# EAGLE board headstage-64_bno55 (EAGLE 9.0.1), part 1 of 2
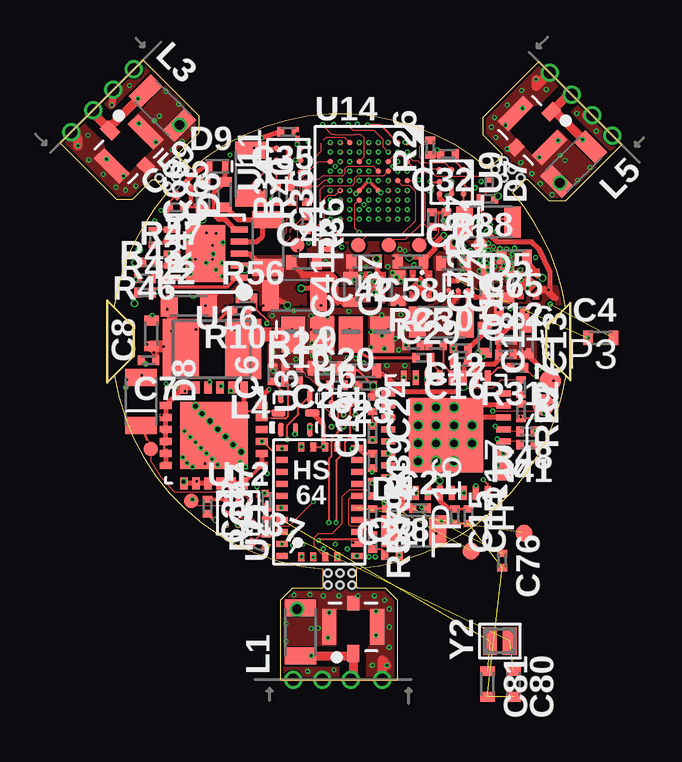
[diagram p5: board, top side]
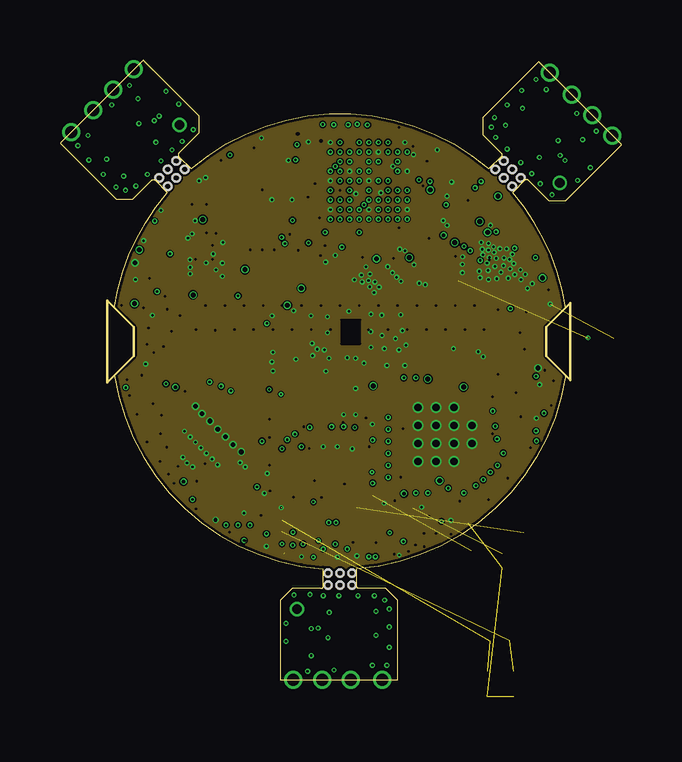
[diagram p6: board, inner layer GND1]
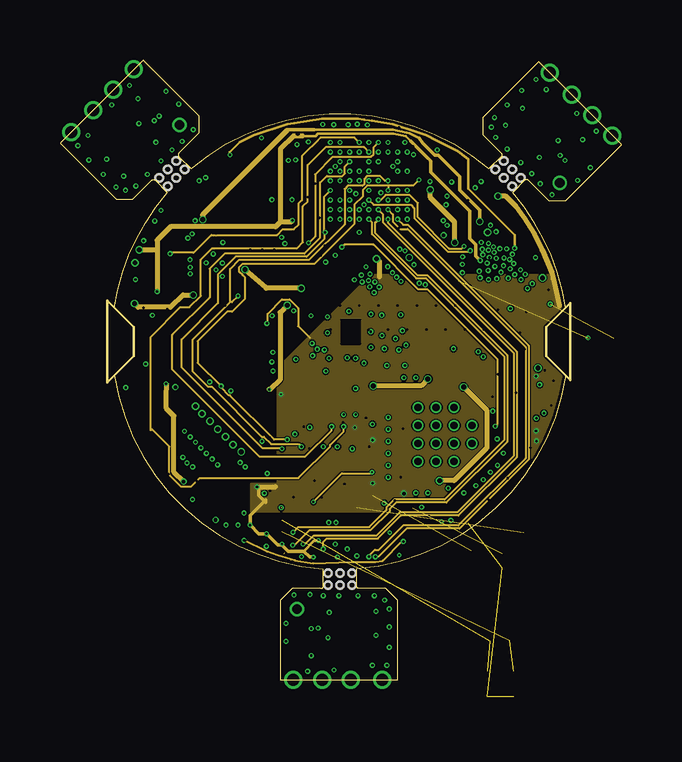
[diagram p7: board, inner layer Route2/PWR]
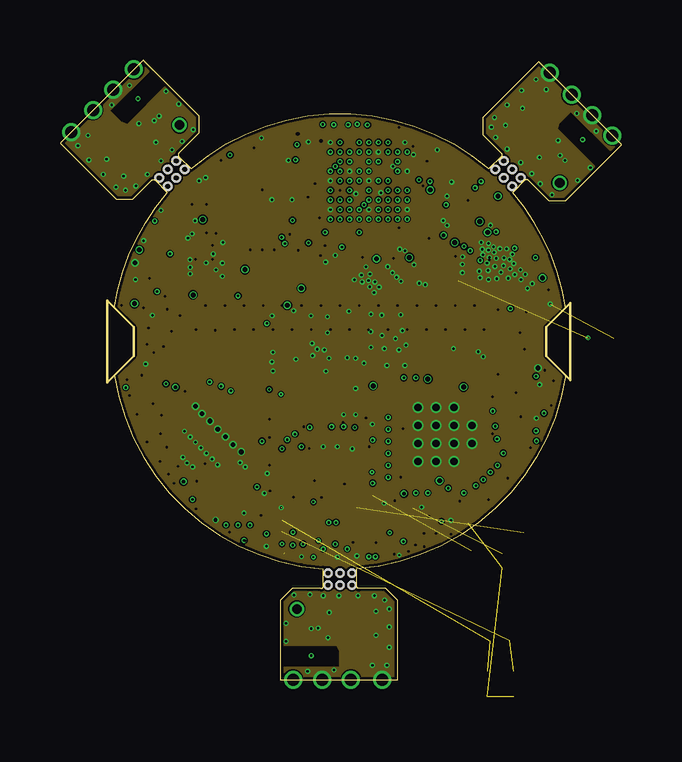
[diagram p8: board, inner layer GND2]
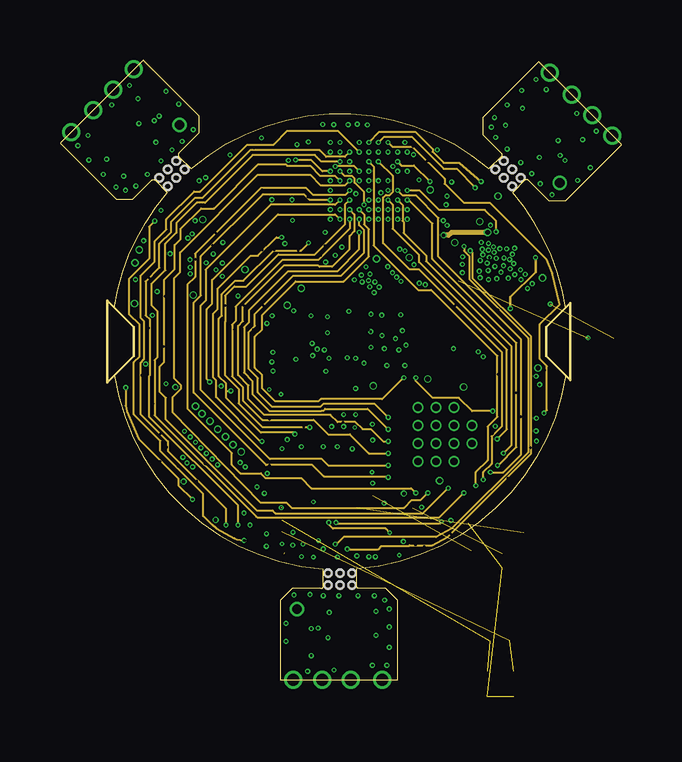
[diagram p9: board, inner layer Route3]
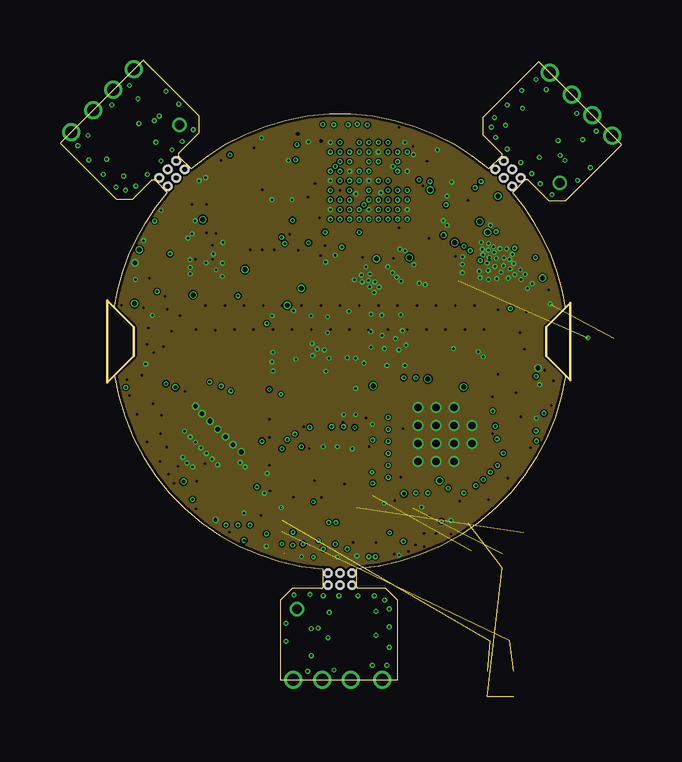
[diagram p10: board, inner layer GND3]
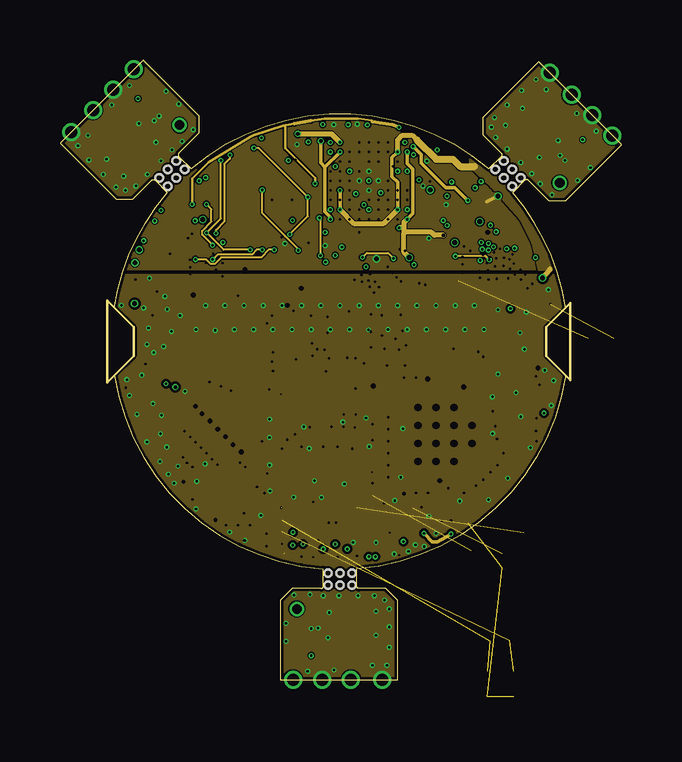
[diagram p11: board, inner layer AGND/PWR]
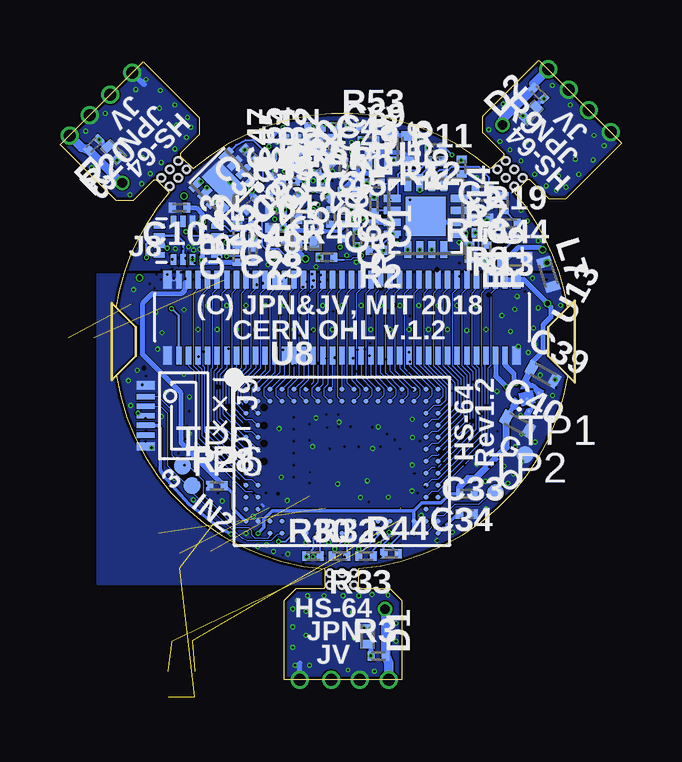
[diagram p12: board, bottom side, seen from below]

Size 23.41 x 25.84 mm. Coordinates in mm from the lower left corner, seen from the top.
Outline: 2.27,15.5 3.07,14.7 3.07,13.5 2.27,12.7 arc77 10.97,4.62 10.97,3.9 arc-90 10.87,3.8 9.67,3.8 9.17,3.3 9.17,0 14.07,0 14.07,3.3 13.57,3.8 12.47,3.8 arc-90 12.37,3.9 12.37,4.62 arc77 21.07,12.7 20.27,13.5 20.27,14.7 21.07,15.5 arc32 18.87,20.3 19.37,20.82 arc-90 19.52,20.82 20.36,19.97 21.07,19.97 23.41,22.3 19.94,25.77 17.61,23.43 17.61,22.73 18.39,21.95 arc-90 18.39,21.81 17.87,21.3 arc81 5.47,21.3 4.95,21.81 arc-90 4.95,21.95 5.8,22.8 5.8,23.5 3.47,25.84 0,22.37 2.33,20.04 3.04,20.04 3.82,20.82 arc-90 3.96,20.82 4.47,20.3 arc32 2.27,15.5
Copper layers ((1*2*3*4*5*6)+(7*16)): Top 0.036mm / dielectric 4mil / GND1 0.036mm / dielectric 5mil / Route2/PWR 0.036mm / dielectric 0.10921875mm / GND2 0.036mm / dielectric 5mil / Route3 0.036mm / dielectric 4mil / GND3 0.035mm / dielectric 0.15mm / AGND/PWR 0.035mm / dielectric 0.2mm / Bottom 0.036mm
Design rules "headstage-256": minimum track width 2mil, minimum drill 3mil, track to track 2mil, track to pad 2mil, pad to pad 2mil, via to via 2mil, smd to smd 2mil, copper to edge 5mil, drill to drill 5mil, minimum pad ring 2mil, minimum via ring 2mil, stop-mask expansion 1mil, vias tented up to drill 1mm, thermal gap 10mil
Net classes: 1 thick: width 0.1 mm; 2 diff: width 0.076 mm, drill 0.1 mm, clearance 0.051 mm
Holes 0.3 mm at 4.84,20.92 4.49,21.28 4.14,20.92 4.84,21.63 4.49,20.57 5.2,21.28 11.67,4.45 11.67,3.95 12.17,3.95 11.17,3.95 12.17,4.45 11.17,4.45 18.49,20.92 18.84,21.28 18.49,21.63 19.2,20.92 18.14,21.28 18.84,20.57
tKeepout: area 2.2,11.2 to 3.7,17; area 2.2,11.2 to 3.7,17; area 19.7,11.2 to 21.2,17; area 19.7,11.2 to 21.2,17
tRestrict: area 1,21.2 to 3.7,24.1; area 11.6,0 to 12.9,2.8; area 18.8,22 to 21.6,24.8; area 11.4,13.6 to 12.8,15.2; 4 lines
Milling: 8 lines

## Footprints (pad centres in the part's own frame; a part is rotated, then mirrored left to right if it is on the bottom)
0201T = smd 0.3 x 0.4: 1 -0.3,0; 2 0.3,0
0402T = smd 0.4 x 0.6: 1 -0.533,0; 2 0.533,0
0402T-DFN = smd 0.35 x 0.6: A -0.325,0; C 0.325,0
0805PT = smd 0.7 x 1.3: A -1,0; C 1,0
LED-0201T = smd 0.2 x 0.35: 1 -0.2,0; 2 0.2,0
CLP1006-2L = smd 0.24 x 0.49: A -0.325,0; C 0.325,0
X_FL_R_SMT_1(02) = smd 0.5 x 0.7: P$1 0,-1.1 | smd 0.6 x 1.5: P$2 -1,0; P$4 1,0 | smd 0.5 x 0.6: P$3 0,1
HEADSTAGE64-DAUGHER-CARD-CASTELLATED = drill 0.5: 1 -2.4,0; 2 -1.2,0; 3 0,0; 4 1.3,0
HEADSTAGE-64-DAUGHTER-CARD = smd 1 x 1.5: 1 -2.4,-0.1; 2 -1.2,-0.1; 3 0,-0.1; 4 1.3,-0.1
DF40-70HEAD-LESS-SILK = smd 0.23 x 0.75: 1 -6.8,-1.585; 2 -6.4,-1.585; 3 -6,-1.585; 4 -5.6,-1.585; 5 -5.2,-1.585; 6 -4.8,-1.585; 7 -4.4,-1.585; 8 -4,-1.585; 9 -3.6,-1.585; 10 -3.2,-1.585; 11 -2.8,-1.585; 12 -2.4,-1.585; 13 -2,-1.585; 14 -1.6,-1.585; 15 -1.2,-1.585; 16 -0.8,-1.585; 17 -0.4,-1.585; 18 0,-1.585; 19 0.4,-1.585; 20 0.8,-1.585; 21 1.2,-1.585; 22 1.6,-1.585; 23 2,-1.585; 24 2.4,-1.585; 25 2.8,-1.585; 26 3.2,-1.585; 27 3.6,-1.585; 28 4,-1.585; 29 4.4,-1.585; 30 4.8,-1.585; 31 5.2,-1.585; 32 5.6,-1.585; 33 6,-1.585; 34 6.4,-1.585; 35 6.8,-1.585; 36 6.8,1.585; 37 6.4,1.585; 38 6,1.585; 39 5.6,1.585; 40 5.2,1.585; 41 4.8,1.585; 42 4.4,1.585; 43 4,1.585; 44 3.6,1.585; 45 3.2,1.585; 46 2.8,1.585; 47 2.4,1.585; 48 2,1.585; 49 1.6,1.585; 50 1.2,1.585; 51 0.8,1.585; 52 0.4,1.585; 53 0,1.585; 54 -0.4,1.585; 55 -0.8,1.585; 56 -1.2,1.585; 57 -1.6,1.585; 58 -2,1.585; 59 -2.4,1.585; 60 -2.8,1.585; 61 -3.2,1.585; 62 -3.6,1.585; 63 -4,1.585; 64 -4.4,1.585; 65 -4.8,1.585; 66 -5.2,1.585; 67 -5.6,1.585; 68 -6,1.585; 69 -6.4,1.585; 70 -6.8,1.585 | smd 0.35 x 0.75: M1 -7.275,-1.585; M2 7.275,-1.585; M3 7.275,1.585; M4 -7.275,1.585
DF40-10HEAD_HALF = smd 0.23 x 0.75: 1 -0.8,-1.585; 2 -0.4,-1.585; 3 0,-1.585; 4 0.4,-1.585; 5 0.8,-1.585 | smd 0.35 x 0.75: M1 -1.275,-1.585; M2 1.275,-1.585
0805T = smd 0.7 x 1.3: 1 -1,0; 2 1,0
0603T = smd 0.7 x 0.9: 1 -0.82,0; 2 0.82,0
1210T = smd 1.5 x 2.5: 1 -1.3,0; 2 1.3,0
TP07R = smd 0.7 x 0.7: TP 0,0
TP09R = smd 0.9 x 0.9: TP 0,0
TP06R = smd 0.6 x 0.6: TP 0,0
CP_16_27-L = smd 0.711 x 0.305: 1 -1.397,0.75; 2 -1.397,0.25; 3 -1.397,-0.25; 4 -1.397,-0.75; 9 1.397,-0.75; 10 1.397,-0.25; 11 1.397,0.25; 12 1.397,0.75 | smd 0.305 x 0.711: 5 -0.75,-1.397; 6 -0.25,-1.397; 7 0.25,-1.397; 8 0.75,-1.397; 13 0.75,1.397; 14 0.25,1.397; 15 -0.25,1.397; 16 -0.75,1.397 | smd 1.651 x 1.651: PAD 0,0
CP_8_10-L = smd 0.635 x 0.305: 1 -0.889,0.75; 2 -0.889,0.25; 3 -0.889,-0.25; 4 -0.889,-0.75; 5 0.889,-0.75; 6 0.889,-0.25; 7 0.889,0.25; 8 0.889,0.75 | smd 0.991 x 1.6: PAD 0,0
QFN24-4X4 = smd 0.5 x 0.3: 1 -2,1.25; 2 -2,0.75; 3 -2,0.25; 4 -2,-0.25; 5 -2,-0.75; 6 -2,-1.25; 13 2,-1.25; 14 2,-0.75; 15 2,-0.25; 16 2,0.25; 17 2,0.75; 18 2,1.25 | smd 0.3 x 0.5: 7 -1.25,-2; 8 -0.75,-2; 9 -0.25,-2; 10 0.25,-2; 11 0.75,-2; 12 1.25,-2; 19 1.25,2; 20 0.75,2; 21 0.25,2; 22 -0.25,2; 23 -0.75,2; 24 -1.25,2 | smd 2.8 x 2.8: PAD 0,0
UQFN = smd 0.55 x 0.25: 1 -0.7,0.6; 3 -0.7,-0.6; 5 0.7,-0.6; 7 0.7,0.6 | smd 0.55 x 0.2: 2 -0.7,0; 6 0.7,0 | smd 0.3 x 0.6: 4 0,-0.7; 8 0,0.7
MQFN16-1.8X2.6 = smd 0.663 x 0.225: 1 -0.7,0.6 | smd 0.463 x 0.225: 2 -0.8,0.2; 3 -0.8,-0.2; 4 -0.8,-0.6; 9 0.8,-0.6; 10 0.8,-0.2; 11 0.8,0.2; 12 0.8,0.6 | smd 0.225 x 0.463: 5 -0.6,-1.2; 6 -0.2,-1.2; 7 0.2,-1.2; 8 0.6,-1.2; 13 0.6,1.2; 14 0.2,1.2; 15 -0.2,1.2; 16 -0.6,1.2
WLCSP3X3 = smd 0.25 x 0.25: A1 -0.5,0.5; A2 0,0.5; A3 0.5,0.5; B1 -0.5,0; B2 0,0; B3 0.5,0; C1 -0.5,-0.5; C2 0,-0.5; C3 0.5,-0.5
BGA104_0.5MM = smd 0.2 x 0.2: A1 -4,3; A2 -3.5,3; A3 -3,3; A4 -2.5,3; A5 -2,3; A6 -1.5,3; A7 -1,3; A8 -0.5,3; A9 0,3; A10 0.5,3; A11 1,3; A12 1.5,3; A13 2,3; A14 2.5,3; A15 3,3; A16 3.5,3; A17 4,3; B1 -4,2.5; B2 -3.5,2.5; B3 -3,2.5; B4 -2.5,2.5; B5 -2,2.5; B6 -1.5,2.5; B7 -1,2.5; B8 -0.5,2.5; B9 0,2.5; B10 0.5,2.5; B11 1,2.5; B12 1.5,2.5; B13 2,2.5; B14 2.5,2.5; B15 3,2.5; B16 3.5,2.5; B17 4,2.5; C1 -4,2; C2 -3.5,2; C16 3.5,2; C17 4,2; D1 -4,1.5; D2 -3.5,1.5; D16 3.5,1.5; D17 4,1.5; E1 -4,1; E2 -3.5,1; E16 3.5,1; E17 4,1; F1 -4,0.5; F2 -3.5,0.5; F16 3.5,0.5; F17 4,0.5; G1 -4,0; G2 -3.5,0; G16 3.5,0; G17 4,0; H1 -4,-0.5; H2 -3.5,-0.5; H16 3.5,-0.5; H17 4,-0.5; J1 -4,-1; J2 -3.5,-1; J16 3.5,-1; J17 4,-1; K1 -4,-1.5; K2 -3.5,-1.5; K16 3.5,-1.5; K17 4,-1.5; L1 -4,-2; L2 -3.5,-2; L16 3.5,-2; L17 4,-2; M1 -4,-2.5; M2 -3.5,-2.5; M3 -3,-2.5; M4 -2.5,-2.5; M5 -2,-2.5; M6 -1.5,-2.5; M7 -1,-2.5; M8 -0.5,-2.5; M9 0,-2.5; M10 0.5,-2.5; M11 1,-2.5; M12 1.5,-2.5; M13 2,-2.5; M14 2.5,-2.5; M15 3,-2.5; M16 3.5,-2.5; M17 4,-2.5; N1 -4,-3; N2 -3.5,-3; N3 -3,-3; N4 -2.5,-3; N5 -2,-3; N6 -1.5,-3; N7 -1,-3; N8 -0.5,-3; N9 0,-3; N10 0.5,-3; N11 1,-3; N12 1.5,-3; N13 2,-3; N14 2.5,-3; N15 3,-3; N16 3.5,-3; N17 4,-3
WQFN32-5X5 = smd 0.25 x 0.6: 1 1.75,2.4; 2 1.25,2.4; 3 0.75,2.4; 4 0.25,2.4; 5 -0.25,2.4; 6 -0.75,2.4; 7 -1.25,2.4; 8 -1.75,2.4; 17 -1.75,-2.4; 18 -1.25,-2.4; 19 -0.75,-2.4; 20 -0.25,-2.4; 21 0.25,-2.4; 22 0.75,-2.4; 23 1.25,-2.4; 24 1.75,-2.4 | smd 0.6 x 0.25: 9 -2.4,1.75; 10 -2.4,1.25; 11 -2.4,0.75; 12 -2.4,0.25; 13 -2.4,-0.25; 14 -2.4,-0.75; 15 -2.4,-1.25; 16 -2.4,-1.75; 25 2.4,-1.75; 26 2.4,-1.25; 27 2.4,-0.75; 28 2.4,-0.25; 29 2.4,0.25; 30 2.4,0.75; 31 2.4,1.25; 32 2.4,1.75 | smd 3.1 x 3.1: PAD 0,0
X2SON = smd 0.1 x 0.1: 1 -0.43,0.33; 2 -0.43,-0.33; 3 0.43,-0.33; 4 0.43,0.33 | smd 0.1 x 0.1 rotated 45: PAD 0,0
VBGA81-4X4 = smd 0.23 x 0.23: A1 1.6,1.6; A2 1.2,1.6; A3 0.8,1.6; A4 0.4,1.6; A5 0,1.6; A6 -0.4,1.6; A7 -0.8,1.6; A8 -1.2,1.6; A9 -1.6,1.6; B1 1.6,1.2; B2 1.2,1.2; B3 0.8,1.2; B4 0.4,1.2; B5 0,1.2; B6 -0.4,1.2; B7 -0.8,1.2; B8 -1.2,1.2; B9 -1.6,1.2; C1 1.6,0.8; C2 1.2,0.8; C3 0.8,0.8; C4 0.4,0.8; C5 0,0.8; C6 -0.4,0.8; C7 -0.8,0.8; C8 -1.2,0.8; C9 -1.6,0.8; D1 1.6,0.4; D2 1.2,0.4; D3 0.8,0.4; D4 0.4,0.4; D5 0,0.4; D6 -0.4,0.4; D7 -0.8,0.4; D8 -1.2,0.4; D9 -1.6,0.4; E1 1.6,0; E2 1.2,0; E3 0.8,0; E4 0.4,0; E5 0,0; E6 -0.4,0; E7 -0.8,0; E8 -1.2,0; E9 -1.6,0; F1 1.6,-0.4; F2 1.2,-0.4; F3 0.8,-0.4; F4 0.4,-0.4; F5 0,-0.4; F6 -0.4,-0.4; F7 -0.8,-0.4; F8 -1.2,-0.4; F9 -1.6,-0.4; G1 1.6,-0.8; G2 1.2,-0.8; G3 0.8,-0.8; G4 0.4,-0.8; G5 0,-0.8; G6 -0.4,-0.8; G7 -0.8,-0.8; G8 -1.2,-0.8; G9 -1.6,-0.8; H1 1.6,-1.2; H2 1.2,-1.2; H3 0.8,-1.2; H4 0.4,-1.2; H5 0,-1.2; H6 -0.4,-1.2; H7 -0.8,-1.2; H8 -1.2,-1.2; H9 -1.6,-1.2; J1 1.6,-1.6; J2 1.2,-1.6; J3 0.8,-1.6; J4 0.4,-1.6; J5 0,-1.6; J6 -0.4,-1.6; J7 -0.8,-1.6; J8 -1.2,-1.6; J9 -1.6,-1.6
DFN103X3 = smd 0.7 x 0.25: 1 -1.4,1; 2 -1.4,0.5; 3 -1.4,0; 4 -1.4,-0.5; 5 -1.4,-1; 6 1.4,-1; 7 1.4,-0.5; 8 1.4,0; 9 1.4,0.5; 10 1.4,1 | smd 1.65 x 2.38: PAD 0,0
XBGA6_1.2X0.8 = smd 0.2 x 0.2: A1 0.2,-0.4; A2 -0.2,-0.4; B1 0.2,0; B2 -0.2,0; C1 0.2,0.4; C2 -0.2,0.4
ASCO = smd 0.6 x 0.5: 1 -0.55,-0.4; 2 0.55,-0.4; 3 0.55,0.4; 4 -0.55,0.4
LGA-28-3.8X5.2 = smd 0.25 x 0.475: 1 -2.25,1.56; 6 -2.25,-1.56; 7 -1.75,-1.56; 8 -1.25,-1.56; 9 -0.75,-1.56; 10 -0.25,-1.56; 11 0.25,-1.56; 12 0.75,-1.56; 13 1.25,-1.56; 14 1.75,-1.56; 15 2.25,-1.56; 20 2.25,1.56; 21 1.75,1.56; 22 1.25,1.56; 23 0.75,1.56; 24 0.25,1.56; 25 -0.25,1.56; 26 -0.75,1.56; 27 -1.25,1.56; 28 -1.75,1.56 | smd 0.375 x 0.25: 2 -2.3,0.75; 3 -2.3,0.25; 4 -2.3,-0.25; 5 -2.3,-0.75; 16 2.3,-0.75; 17 2.3,-0.25; 18 2.3,0.25; 19 2.3,0.75
ECX-1210 = smd 1.14 x 0.575: P$1 0,-0.412; P$2 0,0.412

## Placement (x,y rotation side)
C1  0.1uF  [0201T]  10.35,18.74 270 bottom
C2  0.1uF  [0201T]  15.47,19.8 225 bottom
C3  0.1uF  [0201T]  15.51,21.9 135 bottom
C4  1uF  [0402T]  22.54,14.25 0 top
C5  0.1uF  [0201T]  5.81,19.22 0 bottom
C6  0.1uF  [0201T]  8.85,12.74 90 top
C7  0.1uF  [0201T]  3.69,13.32 180 top
C8  4.7uF  [0402T]  3.81,14.44 90 top
C9  0.1uF  [0201T]  16.02,17.7 90 bottom
C10  0.1uF  [0201T]  18.44,19.68 180 bottom
C11  10nF  [0201T]  18.59,13.56 0 top
C12  0.1uF  [0201T]  18.59,14.17 0 top
C13  4.7uF  [0402T]  19.44,14.14 270 top
C14  0.1uF  [0201T]  17.02,6.82 270 top
C15  10nF  [0201T]  16.45,6.82 270 top
C16  10nF  [0201T]  16.7,13.26 180 top
C17  0.1uF  [0201T]  16.7,13.82 180 top
C18  4.7uF  [0402T]  17.7,14.17 270 top
C19  0.1uF  [0201T]  13.03,10.29 90 top
C20  1uF  [0201T]  11.55,12.28 0 top
C21  0.1uF  [0201T]  15,7.16 0 top
C22  10nF  [0201T]  13.89,7.18 180 top
C23  10nF  [0201T]  12.75,12.25 180 top
C24  0.1uF  [0201T]  13.03,11.48 270 top
C25  22uF  [0402T]  11.06,12.98 180 top
C29  0.1uF  [0201T]  15.14,13.42 0 top
C30  47nF  [0201T]  15.67,13.95 0 top
C31  0.1uF  [0201T]  16.11,19.18 270 top
C32  1uF  [0201T]  16.17,21.92 180 top
C33  10nF  [0201T]  6.47,6.9 0 bottom
C34  0.1uF  [0201T]  6.46,7.75 180 bottom
C35  0.1uF  [0201T]  9.5,22.84 180 top
C36  1uF  [0201T]  8.99,20.22 270 top
C37  0.1uF  [0201T]  8.29,5.6 340 top
C38  1uF  [0201T]  6.15,7.22 270 top
C39  1uF  [0402T]  3.29,12.73 330.9 bottom
C40  10uF  [0402T]  4.35,10.66 330.9 bottom
C41  1uF  [0402T]  12.11,16.26 90 top
C42  10uF  [0402T]  12.67,17.43 180 top
C43  1uF  [0402T]  10.17,17.4 0 top
C44  0.22uF  [0402T]  4.47,17.52 0 bottom
C45  2.2nF  [0201T]  11.37,19.6 0 bottom
C46  4.7nF  [0201T]  14.42,19.6 180 bottom
C47  10nF  [0201T]  14.07,22.3 90 bottom
C48  22nF  [0201T]  10.87,22 0 bottom
C49  47nF  [0201T]  10.87,21.5 0 bottom
C50  0.1uF  [0201T]  12.12,19.3 270 bottom
C51  1uF  [0201T]  11.4,20.36 0 bottom
C52  4.7nF  [0201T]  12.07,22.3 90 bottom
C53  10nF  [0201T]  12.57,22.3 90 bottom
C54  22nF  [0201T]  13.07,22.3 90 bottom
C55  0.47uF  [0201T]  13.57,22.3 90 bottom
C56  10uF  [0402T]  9.61,22.14 270 bottom
C57  1uF  [0402T]  14.09,16.32 90 top
C58  10uF  [0402T]  14.61,17.43 180 top
C59  10pF  [0201T]  5.07,20.43 45 top
C60  4.7nF  [0201T]  12.37,21.3 45 bottom
C61  10nF  [0201T]  12.37,20.3 315 bottom
C62  22nF  [0201T]  13.35,20.3 225 bottom
C63  47nF  [0201T]  13.37,21.3 135 bottom
C64  0.47uF  [0201T]  13.87,20.8 180 bottom
C65  1uF  [0402T]  6.86,20.22 90 top
C66  0.22uF  [0402T]  5.96,20.2 90 top
C67  4.7nF  [0201T]  11.6,18.7 270 bottom
C68  10nF  [0201T]  14.42,18.84 180 bottom
C69  22nF  [0201T]  10.57,22.46 0 bottom
C70  0.47uF  [0201T]  14.61,21.28 270 bottom
C71  2.2uF  [0402T]  16.41,17.36 0 top
C72  4.7uF  [0402T]  17.79,16.48 90 top
C73  10nF  [0201T]  14.37,18.3 180 bottom
C74  1uF  [0402T]  18.63,16.48 90 top
C75  22uF  [0402T]  18.93,17.63 180 top
C76  0.1uF  [0201T]  18.43,4.97 270 top
C77  6.8nF  [0201T]  8.61,7.46 90 top
C78  0.1uF  [0201T]  13.84,5.19 0 top
C79  0.1uF  [0201T]  13.03,6.82 270 top
C80  22pF, NP0 2%  [0402T]  18.9,-0.18 270 top
C81  22pF, NP0 2%  [0402T]  17.81,-0.18 270 top
D1  SESD0402X1UN-0020-090  [0402T-DFN]  10.6,1.81 270 bottom
D2  SESD0402X1UN-0020-090  [0402T-DFN]  3.8,23.64 45 bottom
D3  SESD0402X1UN-0020-090  [0402T-DFN]  21.19,21.99 135 bottom
D4  VEMD1160X01  [0805PT]  14.74,6.19 0 top
D5  VEMD1160X01  [0805PT]  17.86,19.08 180 top
D6  VEMD1160X01  [0805PT]  7.96,21.08 90 top
D7  XZVGR155W  [LED-0201T]  17.89,20.63 270 top
D8  VEMD1160X01  [0805PT]  3.38,11.6 270 top
D9  VSKY05401006  [CLP1006-2L]  6.56,21.4 0 top
J1  [X_FL_R_SMT_1(02)]  12.22,2.2 0 top
J2  [HEADSTAGE64-DAUGHER-CARD-CASTELLATED]  12.12,0 0 top
J3  [X_FL_R_SMT_1(02)]  2.86,22.13 225 top
J4  [HEADSTAGE64-DAUGHER-CARD-CASTELLATED]  1.38,23.75 225 top
J5  [HEADSTAGE-64-DAUGHTER-CARD]  12.12,14.5 0 top
J6  [X_FL_R_SMT_1(02)]  19.69,22.9 135 top
J7  [HEADSTAGE64-DAUGHER-CARD-CASTELLATED]  21.32,24.39 135 top
J8  DF40C-70DP-0.4V(51)  [DF40-70HEAD-LESS-SILK]  11.67,15.1 0 bottom
J9  PINHD-1X5_HALF_CONNETOR  [DF40-10HEAD_HALF]  18.27,11 270 bottom
L1  CIG21L4R7MNE  [0805T]  10.02,1.99 90 top
L2  BLM18KG601SN1D  [0603T]  5.37,15.58 0 top
L3  CIG21L4R7MNE  [0805T]  4.27,23.83 315 top
L4  CBC3225T101MR  [1210T]  6.33,13.78 180 top
L5  CIG21L4R7MNE  [0805T]  21.4,21.5 225 top
L6  BLM15PX601SN1D  [0402T]  18.83,15.26 0 top
L7  BLM15PX601SN1D  [0402T]  3.07,16.9 287.8 bottom
L8  BLM15PX601SN1D  [0402T]  12.66,12.88 180 top
L9  MLZ2012M100WT000  [0805T]  9.77,16.02 180 top
L10  BLM15PX601SN1D  [0402T]  8.89,22.14 90 bottom
L11  MLZ2012M100WT000  [0805T]  8.67,18.18 270 top
L12  LQM21PN1R0NGRD  [0805T]  15.89,14.91 180 top
R1  10k, 0.1%  [0201T]  10.33,19.82 90 bottom
R2  1k, 0.1%  [0201T]  10.23,17.9 180 bottom
R3  1k  [0201T]  10.15,0.99 0 bottom
R4  10k, 0.1%  [0201T]  12.31,17.61 0 bottom
R5  10k, 0.1%  [0201T]  10.33,20.68 0 bottom
R6  10k, 0.1%  [0201T]  6.68,21.39 90 bottom
R7  10k, 0.1%  [0201T]  5.81,20.41 180 bottom
R8  10k, 0.1%  [0201T]  5.81,18.63 180 bottom
R9  1k  [0201T]  3.47,24.44 135 bottom
R10  1k  [0201T]  7.53,15.38 180 top
R11  9k, 0.1%  [0201T]  7.78,21.62 0 bottom
R12  100  [0201T]  7.78,22.18 180 bottom
R13  2.86k  [0201T]  4.73,18.4 180 bottom
R14  10k, 0.1%  [0201T]  4.92,19.87 90 bottom
R15  590  [0201T]  9.67,12.43 0 top
R16  10k, 0.1%  [0201T]  5.65,17.82 270 bottom
R17  10k, 0.1%  [0201T]  6.36,17.82 270 bottom
R18  10k, 0.1%  [0201T]  5.81,19.82 180 bottom
R19  10k, 0.1%  [0201T]  4.67,19.03 0 bottom
R20  1k  [0201T]  22.01,22.3 225 bottom
R21  1k  [0201T]  15.37,17.7 270 bottom
R22  10k  [0201T]  15.37,18.7 90 bottom
R23  10k  [0201T]  16.02,18.71 90 bottom
R24  15k  [0201T]  9.69,13 0 top
R25  49.9  [0201T]  14.72,13.95 0 top
R26  15k  [0201T]  15.43,22.18 90 top
R27  10k  [0201T]  19.21,12.19 270 top
R28  0  [0201T]  16.88,8.08 0 bottom
R29  100k  [0201T]  19.21,11.19 270 top
R30  100  [0201T]  12.87,5.15 0 bottom
R31  10k  [0201T]  19.07,13 180 top
R32  100  [0201T]  11.77,5.15 0 bottom
R33  100  [0201T]  10.67,5.15 180 bottom
R34  15k  [0201T]  9.61,20.22 90 top
R35  10k  [0201T]  14.39,20.24 0 bottom
R36  10k  [0201T]  10.26,19.02 270 top
R37  10k  [0201T]  15.5,19.18 270 top
R38  2k  [0201T]  17.82,20.04 180 top
R39  15k  [0201T]  13.03,9.12 270 top
R40  1k  [0201T]  10.29,20.22 90 top
R41  4.7k  [0201T]  19.47,9.8 180 top
R42  1M  [0201T]  3.54,16.14 0 top
R43  90.9k  [0201T]  3.54,16.74 0 top
R44  100  [0201T]  9.62,5.25 0 bottom
R45  83.3k  [0201T]  3.91,18.42 270 top
R46  10k  [0201T]  3.74,17.4 180 top
R47  1M  [0201T]  4.86,19.69 180 top
R48  4.7k  [0201T]  19.47,10.35 180 top
R49  10k  [0201T]  8.61,6.38 90 top
R50  10k  [0201T]  11.61,21.31 90 bottom
R51  10k  [0201T]  11.71,23.04 180 bottom
R52  10k  [0201T]  12.79,23.04 180 bottom
R53  10k  [0201T]  10.63,23.04 0 bottom
R54  10k  [0201T]  13.03,7.96 270 top
R55  10k  [0201T]  13.03,5.74 270 top
R56  4.7k  [0201T]  7.77,15.9 0 top
R57  4.7k  [0201T]  11.02,18.4 270 bottom
TP1  VCC  [TP07R]  4.05,9.37 0 bottom
TP2  VCC  [TP07R]  5.27,7.8 0 bottom
TP3  [TP09R]  20.42,12.45 0 top
TP4  [TP09R]  20.15,11.45 0 top
TP5  VCC  [TP07R]  18.31,8.91 0 bottom
TP6  VCC  [TP07R]  17.93,8.09 0 bottom
TP7  [TP06R]  3.79,9.62 0 top
TP8  [TP06R]  5.47,7.46 0 top
TP9  [TP06R]  16.24,18.11 0 top
TP10  [TP06R]  11.16,18.11 270 top
TP11  [TP06R]  9.89,18.11 270 top
TP12  [TP06R]  13.7,18.11 270 top
TP13  [TP06R]  12.43,18.11 270 top
TP14  gnd  [TP06R]  14.97,18.11 270 top
TP15  VCC  [TP06R]  17.51,18.11 270 top
TP16  [TP07R]  17.13,5.36 90 top
TP17  [TP07R]  19.33,6.11 90 top
U1  ADA4062-4ACPZ-R7  [CP_16_27-L]  8.18,19.32 0 bottom
U2  AD5681RBCPZ-1RL7  [CP_8_10-L]  16.59,20.73 225 bottom
U3  CAT4016_QFN  [QFN24-4X4]  6.41,10.19 270 top
U4  TPL0501_UQFN  [UQFN]  9.81,11.12 90 top
U5  DG509B  [MQFN16-1.8X2.6]  18.09,18.31 270 bottom
U6  TS4231  [WLCSP3X3]  11.82,11.05 0 top
U8  RHD2064_BGA  [BGA104_0.5MM]  11.67,9.1 0 bottom
U9  TS4231  [WLCSP3X3]  16.32,20.75 270 top
U10  DS90UB913A_WQFN  [WQFN32-5X5]  16.08,10.19 270 top
U11  TS4231  [WLCSP3X3]  9.52,21.65 90 top
U12  TS4231  [WLCSP3X3]  7.42,6.95 0 top
U13  TLV70733  [X2SON]  3.96,11.73 60.9 bottom
U14  10M08DC  [VBGA81-4X4]  12.87,20.8 0 top
U15  TLV70733  [X2SON]  13.11,16.36 270 top
U16  LT3463  [DFN103X3]  6.07,17.76 180 top
U17  TLV70725  [X2SON]  15.03,16.42 270 top
U18  TPS62621  [XBGA6_1.2X0.8]  16.59,16.44 270 top
U19  ASCO-50.000MHZ-EK-T3  [ASCO]  13.17,18.75 90 bottom
U20  TLV70712  [X2SON]  19.51,16.5 270 top
U21  BNO055  [LGA-28-3.8X5.2]  10.81,7.41 90 top
Y2  ECS-.327-12.5-1210-TR  [ECX-1210]  18.33,1.61 90 top

## Tracks (layer width: path | path; a pad name or v marks a point on that pad's centre or on a via)
!IMU_BL  (1 unrouted)
  Top 0.051: 10.89,5.27 | 10.89,5.27 U21.4 | 10.89,5.27 10.57,5.6 10.57,5.9 10.74,6.08 11.32,6.08 11.75,6.5 11.75,7.61 12.05,7.91 12.78,7.91 R54.2
!IMU_RESET
  Top 0.051: U21.11 12.17,7.66 12,7.5 12,6.5 12.1,6.41 12.66,6.41 R55.1
$N324  (via drill 0.1, 0.15 layers 7-16)
  AGND/PWR 0.2: v9.91,22.76 11.31,22.76 U14.A8
  Bottom 0.2: C55.1 C54.1 C53.1 C52.1 U14.A8 | L10.2 C56.1 v9.91,22.76
  other vias: 11.67,22.4
+1V2  (via drill 0.1, 0.1 layers 7-16, 0.2)
  Top 0.2: v20.11,16.75 v20.11,16.76 U20.1 19.75,17.1 19.46,17.39 C75.1
  AGND/PWR 0.15: C45.1 v11.67,20.4 | C47.1 13.83,21.76 13.83,20.98 14.07,20.74 U14.H2
  AGND/PWR 0.2: v20.11,16.75 20.42,17.1 20.42,17.14 | U14.H2 13.47,19 12.27,19 C45.1 | C47.1 14.07,22.5 14.27,22.7 14.65,22.7 14.67,22.7 14.87,22.5
  AGND/PWR 0.3: 17.27,21.4 17.26,21.4 16.67,21.4 16.37,21.7 15.67,21.7 14.87,22.5
  Bottom 0.076: C48.1 U14.B9 | C46.1 U14.H2 | C51.1 v11.67,20.4
  Bottom 0.1: U14.B9 C48.1
  Bottom 0.15: C50.1 C45.1 | C49.1 C48.1
  Bottom 0.2: 11.19,21.43 C49.1 11.04,21.37 11.04,21.12 11.03,21.12 11.02,21.12 | 8.81,21.68 L10.1 | 8.81,21.68 8.79,21.69 | 11.02,21.12 10.92,21.12 10.58,21.11 10.38,21.11 10.25,21.24 10.25,21.75 10.01,22 9.14,22 8.82,21.68 8.81,21.68 | C51.1 11.35,20.71 11.26,20.8 11.26,20.88 11.02,21.12
  other vias: 11.67,19.6 14.07,22 11.27,22 14.07,19.6
  pour AGND/PWR (rank 2): 20.87,17.1 20.87,18.85 17.67,22.05 17.07,22.05 17.07,21.65 17.07,21.4 17.97,20.55 19.17,19.2 19.67,18.2 19.92,17.1
+1V8  (via drill 0.2 layers 1-6)
  Top 0.051: R27.1 18.36,12.49 18.02,12.15 16.87,12.15 v16.82,12.2
  Top 0.102: C14.1 C15.1
  Top 0.15: 16.99,15.04 L12.1 17,14.95
  Top 0.2: 17.67,15.95 17.65,15.92 C72.1 17.28,15.95 U18.C1 16.99,15.06 L12.1 | U10.11 16.83,13.09 C16.1 C17.1 17.04,13.82 17.7,14.48 C18.1 18.25,15.16 L6.1 | U10.11 16.82,12.58 16.82,12.3 16.52,12 14.25,12 13.62,12.63 L8.1 | v15.82,8.3 v15.83,8.29 U10.28 15.83,7.46 16.15,7.14 C15.1 | U10.11 v16.82,12.2
  Route2/PWR 0.2: v16.82,12.2 17.78,11.24 17.78,9.65 17.77,9.65 16.42,8.3 v15.82,8.3
  pour Top (rank 2, no thermals): 17.51,14.78 18.42,14.78 18.42,15.5 18.07,15.5 18.07,16.4 17.51,16.4
+2V5  (via drill 0.1, 0.1 layers 7-16, 0.15 layers 1-6, 0.15 layers 7-16, 0.2, 0.2 layers 1-6)
  Top 0.15: 14.97,17.6 C58.1
  Top 0.2: C58.1 15.14,17.16 U17.1 | 14.97,17.6 v14.56,17.6 | C74.1 18.74,15.95 U20.3 | C58.1 15.14,17.57 | U20.4 20.02,16.17 20.16,16.31 20.57,15.9 20.67,15.9 20.41,16.15 20.41,17 19.92,17.99 19.66,18.25 18.22,18.25 v17.82,18.65 | C58.1 15.14,17.47 15.62,17.95 15.62,18.16 v15.99,18.53
  Route3 0.2: v15.99,18.53 16.19,18.53 16.31,18.65 v17.82,18.65
  AGND/PWR 0.1: U14.J1 14.53,19.26 | 14.53,19.26
  AGND/PWR 0.15: U14.B1 14.47,21.52 14.69,21.29 14.69,19.43 14.53,19.26 U14.J1 | U14.J9 11.27,19.28 11.04,19.51 11.04,21.37 | 11.04,21.37 U14.B8 | C69.1 10.87,21.55 11.04,21.37
  AGND/PWR 0.2: v14.56,17.6 14.33,17.83 14.33,18.6 | v15.99,18.53 15.59,18.53 15.47,18.65 14.38,18.65 arc90 14.33,18.6 | 14.33,18.84 14.33,18.6 | 14.33,18.84 v14.13,18.84 | U14.J1 14.33,19.06 14.33,18.84
  Bottom 0.15: v14.13,18.84 C68.1 | U14.J9 11.49,18.98 11.59,18.88 C67.1
  Bottom 0.152: 11.49,18.98 11.77,18.7 12.38,18.7
  Bottom 0.2: 12.38,18.7 12.52,18.7 12.57,18.75 14.03,18.75 C68.1 | U14.B1 14.47,21.72 C70.1
  other vias: 11.67,22 14.47,22 11.27,19.2 10.87,22.46 14.47,19.2
  pour Top (isolate 0.1, rank 3, no thermals): 18.27,16.4 18.27,15.66 21.47,15.66 21.47,16.4
+3V3  (via drill 0.08 layers 1-6, 0.1, 0.1 layers 1-6, 0.1 layers 7-16, 0.15 layers 1-6, 0.2)  (1 unrouted)
  Top 0.051: v18.25,20.16 18.13,20.09 R38.1 | TP14.TP 15.26,18.4 15.57,18.4 15.79,18.62 15.79,19.48 15.75,19.48 | R48.1 v19.84,10.37 | R41.1 v19.86,9.95 | v19.84,12.65 19.72,12.65 R31.1 | v9.37,18.18 9.6,18.41 9.6,18.75 10.17,19.32 R36.1 | C6.1 9.21,12.08 v9.21,11.9 | R54.1 v13.03,8.19
  Top 0.076: C42.1 13.2,17.55 v13.19,17.55 | U10.25 v14.33,7.76 | C22.1 | C77.1 8.61,7.23 8.22,7.62 8.22,7.97 8.21,7.98 v8.21,8.04 | C37.1 8.28,5.98 R49.1 | U6.C3 v12.28,10.52 | C78.1 13.44,5.44 13.12,5.44 | 13.12,5.44 R55.2 | v10.77,5.8 10.75,5.8 10.82,5.87 12.68,5.87 13.12,5.44 | R56.2 8.18,15.84 8.18,15.43 8.67,14.94 8.67,14.9 v8.62,14.85 | U4.7 v9.21,11.9 | U12.C3
  Top 0.15: C31.1 15.75,19.48 R37.1 | v9.88,22.31 10.02,22.17 U11.C3 | 9.17,5.66 U21.28 | U21.3 10.54,5.12
  Top 0.2: C42.1 13.2,17.12 U15.1 | C21.1 14.33,7.16 14.33,7.18 | 14.33,7.18 U10.25 | C22.1 14.33,7.18 | U9.C3 15.82,20.07 v16.09,19.8 16.11,19.78 C31.1 | C35.1 9.88,22.76 v9.88,22.31
  Route2/PWR 0.076: 10.42,14.25 9.93,14.74 9.93,15.49 9.57,15.85 9.25,15.85 8.65,15.25 8.65,14.88 v8.62,14.85
  Route2/PWR 0.127: 10.15,5.35 10.6,5.8 v10.77,5.8
  Route2/PWR 0.15: U21.3 10.4,5.11 10.15,5.35 9.51,5.35 9.25,5.62 | 9.25,5.62 U21.28 | v8.21,8.04 8.29,7.95 8.29,7.67 8.57,7.4 8.57,7.5 7.92,6.85 U12.C3 8.29,6.08 R49.1 9.07,5.62 9.25,5.62
  Route2/PWR 0.2: v13.19,17.55 13.32,17.42 13.32,16.8 | 20.55,16.72 20.49,16.98 20.09,17.91 19.76,18.6 19.33,19.28 19.01,19.73 18.57,20.16 v18.25,20.16 | 20.55,16.72 | 20.55,16.72 20.81,15.59 | v8.21,8.04 | v8.21,8.04 | v8.21,8.04 8.99,8.04
  AGND/PWR 0.15: v18.25,20.16 17.79,19.94
  Bottom 0.076: 12.84,20.4 U14.F5 13.02,20.4 C62.1 13.04,20.4 | U14.D5 13.04,21.2 C63.1 13.07,21.18 13.07,21.2 | U14.E6 12.47,20.78 | U14.E4 13.27,20.82 | R52.1 v12.39,23.16 | R51.1 v11.41,23.14 | 12.5,21.01 12.15,21.01 R50.1 | U19.1 U19.4 | v15.13,20.58 14.79,20.24 R35.1 | R57.2 v11.05,18.1
  Bottom 0.15: U14.E6 12.47,20.98 12.5,21.01 C60.1 | 12.69,21.2 U14.D5 | 12.89,21.2 13.07,21.2 | 13.27,20.82 13.27,21 | 13.27,20.62 U14.E4 | U14.F5 13.04,20.4 | 12.67,20.4 12.69,20.4 | 12.84,20.4 12.69,20.4 | 12.47,20.6 12.47,20.78 | 12.69,20.4 C61.1
  Bottom 0.2: U14.E4 C64.1 | C61.1 12.72,20.37 | C73.1 13.67,18.3 U19.4 13.57,17.93 v13.19,17.55 | U2.2 15.26,21.71 C3.1 v15.3,21.63 v15.29,21.62
  other vias: 13.27,20.8 12.47,20.8 12.87,21.2 12.87,20.4 15.37,18.4 8.61,6.08 7.92,6.45 10.56,5.11 9.25,5.66 13.03,9.99
  pour AGND/PWR (isolate 0.05, rank 3, no thermals): 1.57,17.1 1.57,17.93 7.54,23.9 15.81,23.9 21.97,17.74 21.97,17.1
  pour Route2/PWR (isolate 0.02, rank 3): 23.07,7 7.97,7 7.97,8.18 9.07,8.18 9.07,13 12.97,16.9 23.07,16.9
+3V3_AN  (via drill 0.1 layers 7-16)
  AGND/PWR 0.15: U8.N2 15.52,5.75 15.72,5.75 16.27,6.05 v16.29,6.07
  Bottom 0.076: U8.M15 U8.M16
  Bottom 0.15: 8.67,7.04 14.58,7.04 14.92,6.7 14.92,6.35 U8.N2 | v16.29,6.07 16.31,6.07 16.81,6.35 17.51,6.91 18.03,7.32 18.97,8.36 | 18.97,8.36 | 18.97,8.36 19.07,8.47 19.24,8.74 | J9.4 19.35,10.6 19.24,10.49 19.24,8.74 | 19.24,8.74 | 19.24,8.74
  Bottom 0.152: C34.2 7.16,7.75 7.55,7.36 8.35,7.36 8.67,7.04 U8.M15 U8.N15
  Bottom 0.2: U13.1 C40.1
  Bottom 0.3: C40.1 4.82,9.69 6.11,8.4 6.41,8.4 6.76,8.05 C34.2
  other vias: 15.17,6.1
+15V0  (via drill 0.1, 0.1 layers 1-6, 0.2)
  Top 0.076: R42.2 4.05,16.14 v4.05,16.18
  Top 0.15: 7.37,16.76 6.97,16.36 4.16,16.36 R42.2
  Top 0.2: U16.1 7.37,16.76
  Route2/PWR 0.1: v17.51,17.48 17.51,17.47 | 14.61,22.45 14.41,22.66 13.89,22.76 10.75,22.76 10.66,22.67 10.1,22.67
  Route2/PWR 0.15: v17.51,17.48 17.32,17.66 17.32,18.14 17.07,18.4 17.07,19.54 16.22,20.39 15.45,21.16 15.45,21.62 14.61,22.45
  Route2/PWR 0.2: 4.05,17.9 4.05,18.32 4.61,18.88 8.99,18.88 9.19,19.08 | 4.05,17.9 v4.05,16.18 | 4.05,17.9 4.03,17.92 v3.31,17.92 | 10.1,22.67 9.74,22.67 9.19,22.12 9.19,19.08 | v9.69,19.15 9.62,19.08 9.19,19.08
  Bottom 0.076: v17.51,17.48 U5.12
  Bottom 0.2: C9.1 17.43,17.4 arc90 v17.51,17.48 | v3.31,17.92 3.4,18.01 4.34,18.01 4.83,17.52 C44.1 | C1.1 10.32,19.07 U1.3 9.65,19.15 v9.69,19.15
-15V0  (via drill 0.2)
  Top 0.2: 5.8,19.75 C66.1 | 5.73,19.75 C66.1 | D9.A 6.01,21.4 5.56,21.07 5.28,20.79 C59.2 5.45,20.47 5.45,19.76 | C66.1 5.96,19.2 v5.95,19.18 | C66.1 5.96,19.76 5.45,19.76 | R47.1 5.23,19.76 5.45,19.76
  Route2/PWR 0.1: 14.98,22.59 14.55,22.78 14.44,22.81 13.86,22.93 10.6,22.93 | 9.57,22.93 9.47,22.93
  Route2/PWR 0.15: v17.49,19.1 17.49,19.58 16.65,20.42 16.65,20.98 15.76,21.86 15.62,21.86 15.12,22.37 14.98,22.59 | 10.6,22.93 9.57,22.93 9.49,22.93 9.47,22.9
  Route2/PWR 0.2: 9.47,22.9 8.94,22.37 5.95,19.38 v5.95,19.18
  Bottom 0.076: U5.1
  Bottom 0.1: 17.48,19.16 U5.1
  Bottom 0.15: U5.1 v17.49,19.1
  Bottom 0.2: C10.1 17.75,19.68 17.49,19.42 v17.49,19.1 | U1.PAD 7.93,19.07 U1.10 6.26,19.07 v5.95,19.18 6.07,19.18 C5.1
_SIGOUT  (via drill 0.1)
  Top 0.2: 3.23,24.2 3.23,24.54 L3.1 3.25,24.54 v3.25,24.22
  Top 0.37: J4.3 1.38,23.61 J3.P$1 2.09,23.06 3.23,24.2
  Bottom 0.2: v3.25,24.22 R9.1 3.57,23.92 D2.C
_SIGOUT1  (via drill 0.1)
  Top 0.2: v10.47,1 10.37,0.99
  Top 0.37: 10.37,0.99 12.11,0.99 | J1.P$1 12.22,0.1 arc-90 J2.3
  Top 0.4: 12.12,1 J1.P$1 12.11,0.99 | L1.1 v10.47,1
  Bottom 0.127: R3.1 R3.1 arc90 v10.47,1
  Bottom 0.2: R3.1 10.45,1.33 D1.C
_SIGOUT2  (via drill 0.1)
  Top 0.2: v21.78,22.52 21.86,22.45
  Top 0.37: 21.86,22.45 20.63,23.68 | J6.P$1 21.18,24.39 arc-90 J7.3
  Top 0.4: 20.61,23.68 J6.P$1 20.63,23.68 | L5.1 22.09,22.2 v21.78,22.52
  Bottom 0.127: R20.1 R20.1 arc90 v21.78,22.52
  Bottom 0.2: R20.1 21.51,22.22 D3.C
AGND  (via drill 0.1 layers 7-16)
  Bottom 0.127: 18.96,16.7 J8.M4 J8.70 | J8.M1 18.96,13.5 | 4.38,13.5 J8.M2 | 15.01,7.3 14.95,7.24
  Bottom 0.15: 19.6,9.72 v19.6,9.67
  other vias: 5.67,7.12 12.22,5.72 4.76,8.19 5.7,8.27 3.88,11.51 3.21,11.06 4.23,11.02 2.9,11.85 3.63,13.98 3.69,14.66 2.56,15.61 4.47,15.44 4.65,14.52 3.49,15.5 4.37,15.98 4.17,9.1 20.2,12.9 20.57,12.47 20.47,11.43 18.25,15.42 3.41,12.7 3.91,13.64 5.01,15.18 7.71,5.8 13.93,5.24 13.17,5.72 14.52,5.35 5.67,14.6 6.07,15.6 6.47,14.56 6.87,15.6 7.27,14.6 7.67,15.6 8.07,14.6 8.47,15.6 9.26,15.6 10.07,15.6 10.87,15.6 12.47,15.6 11.67,15.6 13.27,15.6 14.07,15.6 14.87,15.6 15.67,15.6 16.47,15.6 17.27,15.6 8.87,14.6 9.67,14.6 10.47,14.6 11.27,14.6 12.07,14.6 12.86,14.59 14.47,14.6 15.27,14.6 16.07,14.6 16.87,14.6 17.67,14.6 14.81,5.62 19.35,13.78 19.17,14.46 18.25,12.74 20.35,16.26 2.79,12.51 4.19,10.25 3.73,16.74 5.21,12.02 4.32,13.89 8.74,10.86 8.73,10.1 8.74,8.95 8.75,7.87 9.74,7.61 10.9,7.6 11.85,8.16 10.61,8.29 12.75,10.91 11.79,10.74 19.43,15.33 7.07,6.15 15.37,6.82 15.67,6.1 13.67,14.6 3.62,9.91 4.52,8.57 6.05,9 4.45,9.7 19.2,10.97 14.2,8.44 14.29,10.47 12.89,9.72 13.95,7.47 10.39,9.64 10.16,10.54 18.03,10.26 18.02,11.79 16.66,7.45 4.92,8.9 17.86,7.5 18.66,8.4 19,11.97 15.18,5.55 8.37,6.85
  pour AGND/PWR (isolate 0.1, rank 3): 1.57,16.9 21.97,16.9 21.97,4.5 1.57,4.5
  pour Bottom (isolate 0.05, rank 3, no thermals): 0.27,16.9 21.87,16.9 21.87,4 0.27,4
AUXIN2
  Bottom 0.051: U8.N4 14.19,6.07 14.34,6.07 14.62,5.8 15.64,5.8 15.8,5.88 | 15.9,5.97 15.82,5.9 15.8,5.88 | 15.8,5.88 15.9,5.97 | J9.2 19.22,11.4 18.94,11.12 18.94,8.94 18.09,8.09 TP6.TP 18.03,7.94 17.22,7.13 15.9,5.97
AUXIN3
  Bottom 0.051: U8.N3 14.67,6 14.77,5.9 15.29,5.9 15.42,6.03 15.42,6.21 15.54,6.33 16.07,6.33 16.98,7.24 17.43,7.69 17.43,7.7 17.43,8.28 18.26,9.11 TP5.TP 18.77,9.36 18.77,10.7 18.77,11.25 19.32,11.8 J9.1
CONF_DONE  (via drill 0.1)
  Top 0.076: v12.81,23.13 13.34,23.13 U14.A2
  Bottom 0.076: R52.2 13.09,23.08 13.06,23.11 v12.81,23.13
CONFIG_SEL  (via drill 0.1)
  Top 0.051: U14.C6 12.67,21.8 12.67,22.6 12.54,22.73 12.31,22.73 11.46,22.73 11.33,22.73 10.95,23.11 v10.95,23.15
  Bottom 0.076: R53.1 v10.95,23.15
DAC_CS  (via drill 0.1, 0.1 layers 1-6)
  Route3 0.076: U14.A5 13.31,22.84 14.81,22.84 15.53,22.12 15.53,22.01 15.99,21.55 16.63,21.55 v17.55,20.77
  Bottom 0.076: U2.5 17.69,20.63 v17.55,20.77
  other vias: 12.87,22.4
DATA1  (via drill 0.1 layers 1-6)
  Route2/PWR 0.076: U14.C7 11.87,21.4 11.87,21.1 11.77,21 11.12,21 10.84,20.72 10.84,18.43 10.18,17.76 6.86,17.76 6.23,17.13 6.23,15.93 4.68,14.38 4.68,12.93 8.31,9.3 10.22,9.3 11.32,10.4 U6.C1
  other vias: 11.32,10.55 12.07,21.6
DATA2
  Top 0.051: U14.C3 13.87,21.8 14.53,21.8 14.54,21.79 14.55,21.79 14.71,21.62 14.93,21.62 15.26,21.3 15.82,21.3 U9.C1
DATA3
  Top 0.051: U14.A7 11.87,22.6 11.07,22.6 10.86,22.39 10.86,22 U11.C1
DATA4  (via drill 0.1 layers 1-6)
  Top 0.076: U12.C1 6.94,6.41 6.93,6.52 U12.C1
  Route3 0.076: U14.B6 11.58,22.88 9.48,22.88 8.9,22.31 8.04,22.31 8.04,22.3 7.8,22.3 5.84,20.35 5.59,20.35 4.44,19.2 4.44,18.77 3.93,18.26 3.93,17.41 3.35,16.83 3.35,15.1 3.5,14.95 3.5,13.36 3.35,13.21 3.35,11.86 | U12.C1 6.92,7.11 4.5,9.53 4.5,9.93 3.35,11.08 3.35,11.86 | 3.35,11.86
  other vias: 6.92,6.45 12.47,22
DIN0  (via drill 0.1 layers 1-6)
  Route3 0.076: U14.J6 12.47,18.95 12.67,18.75 12.67,17.8 11.7,16.83 9.7,16.83 8.12,15.25 8.12,14.75 7.87,14.5 7.87,12.95 8.24,12.57 8.24,11.97 8.82,11.39 10.87,11.39 10.96,11.49 13.12,11.49 U10.19
  other vias: 13.68,10.94 12.47,19.2
DIN1  (via drill 0.1 layers 1-6)
  Top 0.051: U14.G6 12.27,19.8 12.27,18.85 v12.47,18.65
  Route3 0.076: v12.47,18.65 12.47,17.95 11.54,17.02 9.49,17.02 7.87,15.4 7.87,14.9 7.67,14.7 7.67,12.8 8.02,12.45 8.02,11.91 8.72,11.21 10.9,11.21 10.97,11.21 11.05,11.29 12.82,11.29 U10.20
  other vias: 13.68,10.44
DIN2  (via drill 0.1 layers 1-6)
  Route3 0.076: U14.H7 12.27,19.4 12.27,18.7 12.07,18.5 12.07,17.95 11.34,17.22 10.8,17.22 10.77,17.26 9.32,17.26 7.62,15.55 7.62,14.95 7.42,14.75 7.42,12.7 7.85,12.27 7.85,11.7 8.51,11.04 11.27,11.04 11.56,10.74 12.31,10.74 12.61,10.44 12.96,10.44 13.46,9.93 U10.21
  other vias: 13.68,9.94 12.07,19.6
DIN3  (via drill 0.1 layers 1-6)
  Route3 0.076: U14.J7 12.07,18.8 10.77,17.5 9.27,17.5 7.32,15.55 7.32,14.95 7.17,14.8 7.17,12.65 7.62,12.2 7.62,11.65 8.43,10.83 10.57,10.83 11.17,10.23 12.07,10.23 12.87,9.43 U10.22
  other vias: 12.07,19.2 13.68,9.44
DIN4  (via drill 0.1 layers 1-6)
  Route3 0.076: U14.G8 11.47,19.8 8.78,19.8 6.07,17.09 6.07,15.8 5.87,15.6 5.87,12.08 8.21,9.74 8.75,9.2 10.92,9.2 11.19,8.93 13.67,8.93 U10.23
  other vias: 13.68,8.94 11.67,20
DIN5  (via drill 0.1 layers 1-6)
  Route3 0.076: U14.G9 10.4,20 10.17,20.23 8.45,20.23 5.87,17.65 5.87,16.02 5.57,15.72 5.57,11.97 8.59,8.95 10.52,8.95 10.99,8.47 13.64,8.47 U10.24
  other vias: 13.68,8.44 11.27,20
DIN6  (via drill 0.1 layers 1-6)
  Top 0.076: U14.F7
  Route3 0.076: U14.F7 11.88,20.21 10.55,20.21 10.27,20.49 8.36,20.49 5.63,17.76 5.63,16.79 5.31,16.46 5.31,11.3 7.16,9.45 7.16,8.96 7.52,8.6 8.37,8.6 8.56,8.41 10.05,8.41 10.48,7.98 14.63,7.98 U10.26
  other vias: 12.07,20.4 14.83,7.79
DIN7  (via drill 0.1 layers 1-6)
  Route3 0.076: U10.27 15.03,7.49 14.65,7.49 14.34,7.17 9.65,7.17 9.44,7.38 8.36,7.38 4.68,11.16 4.68,11.77 5.02,12.11 5.02,12.29 4.74,12.57 4.74,16.73 5,16.99 5,17.81 8.24,21.05 10.42,21.05 10.87,20.6 11.87,20.6 U14.E7
  other vias: 15.33,7.79 12.07,20.8
DIN8  (via drill 0.1 layers 1-6)
  Top 0.076: U10.29 16.33,7.98 v16.18,7.98
  Route3 0.076: U14.E8 11.47,21 10.84,21 10.42,21.43 9.47,21.43 9.4,21.49 8.26,21.49 6.42,19.65 5.88,19.65 5.03,18.8 5.03,18.38 4.78,18.13 4.78,17.11 4.34,16.68 4.34,13.24 4.15,13.05 4.15,12 4.41,11.74 4.41,10.84 8.22,7.04 8.87,7.04 8.97,6.93 15.13,6.93 v16.18,7.98
  other vias: 11.67,20.8
DIN9  (via drill 0.1 layers 1-6)
  Route3 0.076: U14.C8 10.89,21.6 10.62,21.88 8.03,21.88 6.04,19.89 5.71,19.89 4.85,19.03 4.85,18.63 4.39,18.18 4.39,17.07 3.81,16.49 3.81,15.61 4.07,15.35 4.07,13.45 3.94,13.32 3.94,11.02 8.17,6.8 8.18,6.8 8.22,6.76 15.8,6.76 U10.30
  other vias: 16.83,7.79 11.67,21.6
DIN10  (via drill 0.1 layers 1-6)
  Top 0.076: U10.31 v17.33,8.09
  Route3 0.076: U14.C5 13.07,21.4 13.07,18.1 14.92,16.25 15.47,16.25 18.22,13.5 18.22,10.95 17.82,10.55 17.82,9.15 17.33,8.66 v17.33,8.09
  other vias: 12.87,21.6
DIN11  (via drill 0.1 layers 1-6)
  Top 0.076: 17.83,7.85 U10.32 17.83,8.15 v17.64,8.34
  Route3 0.076: v17.64,8.34 17.64,8.65 17.98,9 17.98,10.15 18.42,10.58 18.42,13.65 14.97,17.1 14.57,17.1 13.47,18.2 13.47,20.1 13.58,20.21 13.75,20.21 13.86,20.32 13.86,21.01 U14.C4
  other vias: 13.27,21.6
E0
  Bottom 0.051: J8.2 18.07,13.1 17.77,12.8 17.77,9.93 15.69,7.85 15.42,7.85 U8.K2
E1
  Bottom 0.051: J8.68 17.67,16.3 17.87,16.1 17.87,13.1 17.64,12.88 17.64,10.07 U8.J1
E2
  Bottom 0.051: J8.3 17.67,13.1 17.52,12.95 17.52,10.18 15.69,8.35 15.42,8.35 U8.J2
E3
  Bottom 0.051: J8.67 17.27,16.3 17.47,16.1 17.47,13.1 17.39,13.03 17.39,10.32 U8.H1
E4
  Bottom 0.051: J8.4 17.27,10.43 15.69,8.85 15.42,8.85 U8.H2
E5
  Bottom 0.051: J8.66 16.87,16.3 17.07,16.1 17.07,13 17.14,12.92 17.14,10.57 U8.G1
E6
  Bottom 0.051: J8.5 16.87,13 17.02,12.85 17.02,10.68 15.69,9.35 15.42,9.35 U8.G2
E7
  Bottom 0.051: J8.65 16.47,16.3 16.67,16.1 16.67,13 16.89,12.78 16.89,10.82 U8.F1
E8
  Bottom 0.051: J8.6 16.47,13 16.77,12.7 16.77,10.93 15.69,9.85 15.42,9.85 U8.F2
E9
  Bottom 0.051: J8.64 16.07,16.3 16.27,16.1 16.27,13 16.64,12.62 16.64,11.07 U8.E1
E10
  Bottom 0.051: J8.7 16.07,13 16.52,12.55 16.52,11.18 15.69,10.35 15.42,10.35 U8.E2
E11
  Bottom 0.051: J8.63 15.67,16.3 15.87,16.1 15.87,13 16.39,12.47 16.39,11.32 U8.D1
E12
  Bottom 0.051: J8.8 15.67,13 16.27,12.4 16.27,11.43 15.69,10.85 15.42,10.85 U8.D2
E13
  Bottom 0.051: J8.62 15.27,16.3 15.47,16.1 15.47,13 16.14,12.32 16.14,11.57 U8.C1
E14
  Bottom 0.051: J8.9 15.27,13 16.02,12.25 16.02,11.7 15.67,11.35 15.42,11.35 U8.C2
E15
  Bottom 0.051: J8.61 14.87,16.3 15.07,16.1 15.07,12.97 15.89,12.15 15.89,11.82 U8.B1
E16
  Bottom 0.051: U8.A1 14.87,12.9 J8.10
E17
  Bottom 0.051: J8.60 14.47,16.3 14.67,16.1 14.67,12.9 15.42,12.15 15.42,11.85 U8.B2
E18
  Bottom 0.051: U8.A2 14.47,12.8 J8.11
E19
  Bottom 0.051: J8.59 14.07,16.3 14.27,16.1 14.27,12.8 14.92,12.15 14.92,11.85 U8.B3
E20
  Bottom 0.051: U8.A3 14.07,12.7 J8.12
E21
  Bottom 0.051: J8.58 13.67,16.3 13.87,16.1 13.87,12.7 14.42,12.15 14.42,11.85 U8.B4
E22
  Bottom 0.051: U8.A4 13.67,12.6 J8.13
E23
  Bottom 0.051: J8.57 13.27,16.3 13.47,16.1 13.47,12.6 13.92,12.15 13.92,11.85 U8.B5
E24
  Bottom 0.051: U8.A5 13.27,12.5 J8.14
E25
  Bottom 0.051: J8.56 12.87,16.3 13.07,16.1 13.07,12.5 13.42,12.15 13.42,11.85 U8.B6
E26
  Bottom 0.051: U8.A6 12.87,12.4 J8.15
E27
  Bottom 0.051: J8.55 12.47,16.3 12.67,16.1 12.67,12.4 12.92,12.15 12.92,11.85 U8.B7
E28
  Bottom 0.051: U8.A7 12.47,12.3 J8.16
E29
  Bottom 0.051: J8.54 12.07,16.3 12.27,16.1 12.27,12.3 12.42,12.15 12.42,11.85 U8.B8
E30
  Bottom 0.051: U8.A8 12.07,12.2 J8.17
E31
  Bottom 0.051: J8.53 11.67,16.3 11.87,16.1 11.87,11.8 U8.B9
E32
  Bottom 0.051: J8.18 U8.A9
E33
  Bottom 0.051: J8.52 11.27,16.3 11.47,16.1 11.47,12.4 U8.A10
E34
  Bottom 0.051: J8.19 11.27,12.5 10.92,12.15 10.92,11.85 U8.B10
E35
  Bottom 0.051: J8.51 10.87,16.3 11.07,16.1 11.07,12.5 U8.A11
E36
  Bottom 0.051: J8.20 10.87,12.6 10.42,12.15 10.42,11.85 U8.B11
E37
  Bottom 0.051: J8.50 10.47,16.3 10.67,16.1 10.67,12.6 U8.A12
E38
  Bottom 0.051: J8.21 10.47,12.7 9.92,12.15 9.92,11.85 U8.B12
E39
  Bottom 0.051: J8.49 10.07,16.3 10.27,16.1 10.27,12.7 U8.A13
E40
  Bottom 0.051: J8.22 10.07,12.8 9.42,12.15 9.42,11.85 U8.B13
E41
  Bottom 0.051: J8.48 9.67,16.3 9.87,16.1 9.87,12.8 U8.A14
E42
  Bottom 0.051: J8.23 9.67,12.9 8.92,12.15 8.92,11.85 U8.B14
E43
  Bottom 0.051: J8.47 9.27,16.3 9.47,16.1 9.47,12.9 U8.A15
E44
  Bottom 0.051: J8.24 9.27,13 8.42,12.15 8.42,11.85 U8.B15
E45
  Bottom 0.051: J8.46 8.87,16.3 9.07,16.1 9.07,13 U8.A16
E46
  Bottom 0.051: J8.25 8.87,13.1 7.92,12.15 7.92,11.85 U8.B16
E47
  Bottom 0.051: J8.45 8.47,16.3 8.67,16.1 8.67,13.1 U8.A17
E48
  Bottom 0.051: J8.26 8.47,13.15 7.47,12.15 7.47,11.8 U8.B17
E49
  Bottom 0.051: J8.44 8.07,16.3 8.27,16.1 8.27,13.1 7.34,12.17 7.34,11.65 7.57,11.42 7.84,11.42 U8.C16
E50
  Bottom 0.051: J8.27 8.07,13.1 7.22,12.25 7.22,11.55 U8.C17
E51
  Bottom 0.051: J8.43 7.67,16.3 7.87,16.1 7.87,13.1 7.09,12.32 7.09,11.43 7.67,10.85 7.92,10.85 U8.D16
E52
  Bottom 0.051: J8.28 7.67,13.1 6.97,12.4 6.97,11.3 U8.D17
E53
  Bottom 0.051: J8.42 7.27,16.3 7.47,16.1 7.47,13.1 6.84,12.47 6.84,11.18 7.67,10.35 7.92,10.35 U8.E16
E54
  Bottom 0.051: J8.29 7.27,13.1 6.72,12.55 6.72,11.05 U8.E17
E55
  Bottom 0.051: J8.41 6.87,16.3 7.07,16.1 7.07,13.1 6.59,12.62 6.59,10.93 7.67,9.85 7.92,9.85 U8.F16
E56
  Bottom 0.051: J8.30 6.87,13.1 6.47,12.7 6.47,10.8 U8.F17
E57
  Bottom 0.051: J8.40 6.47,16.3 6.67,16.1 6.67,13.1 6.34,12.78 6.34,10.68 7.67,9.35 7.92,9.35 U8.G16
E58
  Bottom 0.051: J8.31 6.47,13.1 6.22,12.85 6.22,10.55 U8.G17
E59
  Bottom 0.051: J8.39 6.07,16.3 6.27,16.1 6.27,13.1 6.09,12.92 6.09,10.43 7.67,8.85 7.92,8.85 U8.H16
E60
  Bottom 0.051: J8.32 6.07,13.1 5.97,13 5.97,10.32 U8.H17
E61
  Bottom 0.051: J8.38 5.67,16.3 5.87,16.1 5.87,13.1 5.84,13.03 5.84,10.18 7.67,8.35 7.92,8.35 U8.J16
E62
  Bottom 0.051: J8.33 5.72,13.52 5.72,10.05 U8.J17
E63
  Bottom 0.051: J8.37 5.27,16.3 5.47,16.1 5.47,13.1 5.59,12.98 5.59,9.93 7.67,7.85 7.92,7.85 U8.K16
ENV1  (via drill 0.1 layers 1-6)
  Route2/PWR 0.076: U14.B5 12.67,22.2 11.07,22.2 10.32,21.45 10.32,19.94 10.12,19.74 10.12,18.23 9.88,17.99 6.34,17.99 5.87,17.51 5.87,16 5.4,15.53 5.02,15.53 3.77,14.28 3.77,10.4 3.82,10.45 4.56,9.71 4.56,8.54 5.06,8.04 5.46,8.04 5.82,8.41 9.94,8.41 11.26,9.73 11.26,9.79 11.82,10.35 U6.C2
  other vias: 11.82,10.55 12.87,22
ENV2  (via drill 0.1 layers 1-6)
  Top 0.076: v15.42,20.77 15.44,20.75 U9.C2
  Route3 0.076: U14.C2 14.23,21.44 14.75,21.44 v15.42,20.77
  other vias: 14.07,21.6
ENV3  (via drill 0.1 layers 1-6)
  Top 0.1: v9.82,21.67 10.02,21.67
  Top 0.102: 10.02,21.67 U11.C2
  Route3 0.076: v9.82,21.67 10.47,21.67 10.94,21.2 U14.D9
  other vias: 11.27,21.2
ENV4  (via drill 0.1 layers 1-6)
  Route3 0.076: U14.B7 11.87,21.8 11.09,21.8 10.82,22.07 7.92,22.07 5.92,20.08 5.62,20.08 4.63,19.09 4.63,18.66 4.14,18.18 4.14,17.17 3.57,16.6 3.57,15.19 3.75,15 3.76,15 3.76,12.7 3.73,12.67 3.73,10.95 7.42,7.26 U12.C2
  other vias: 7.42,6.45 12.07,22
ESTIM_POW_EN  (via drill 0.1 layers 1-6)
  Top 0.076: 4.04,17.26 R46.1 4.18,17.26 U16.9 U16.8 v4.59,17.76
  Route2/PWR 0.076: v4.59,17.76 4.59,17.78 4.61,17.8 5.57,17.8 6.31,18.54 9.05,18.54 9.29,18.78 9.75,18.78 9.95,18.98 9.95,19.86 10.08,19.99 10.08,21.82 10.86,22.6 12.27,22.6 U14.A6
  other vias: 12.47,22.4
GND  (via drill 0.08 layers 1-6, 0.1, 0.1 layers 1-6, 0.15 layers 1-6, 0.2, 0.2 layers 1-6, 0.3 layers 1-6)  (5 unrouted)
  Top 0.051: 12.45,20.29 12.4,20.32 v12.33,20.26 | U14.F6 12.47,20.3 | 15.47,21.88 R26.1 | 3.37,16.76 R43.1 | C17.2 v16.4,13.8 | 18.41,11.5 U10.7 | U10.PAD v16.42,9.85 | v19.99,12.3 20.27,12.3 TP3.TP | U14.E9 10.99,20.8 10.76,20.57 10.4,20.57 R40.2
  Top 0.076: U3.1 7.69,12.16 | 6.27,17.96 U16.PAD v6.09,17.38 | v16.4,13.8 C16.2 | 15.29,7.17 C21.2 | C22.2 13.49,7.27 13.57,7.29 | v12.32,12.14 v12.33,12.15 C23.2 11.88,12.25 C20.2 | R43.1 3.21,16.74 v3.15,16.68 | v19.85,10.9 R29.2 | v6.58,10.44 U3.PAD 7.45,10.19 7.68,10.81 7.68,11.12 7.75,11.2 9.03,11.2 U4.8 | 15.83,21.86 C32.2 | v19.48,16.31 19.48,16.47 U20.PAD | 8.89,19.94 C36.2 | 8.89,19.94 | C77.2 v8.52,7.77 | U21.2 v10.06,5.12 v10.06,5.13 | U21.18 v10.97,9.71 U21.17 | C37.2 8.57,5.53 v8.6,5.56 | U21.15 12.31,9.66 v12.18,9.62 | C24.2 v13.02,10.65 C19.2
  Top 0.1: U14.F4 v13.37,20.3 | C31.2 16.13,18.9 v16.13,18.94
  Top 0.102: C15.2 C14.2
  Top 0.127: R39.1 12.61,9.42 U21.15 | C79.1 C22.2
  Top 0.15: v13.37,20.3 U14.E5 U14.F6 v12.33,20.26 | 7.97,6.94 U12.B3 U12.B2 v7.66,6.94 v7.67,6.95 | R34.1 v9.67,20.01 | v6.49,6.66 6.41,6.66 C38.2 | U14.A1 14.43,22.36 v14.37,22.4
  Top 0.2: 12.13,16.94 C42.2 | 12.13,16.94 C41.2 | 12.13,16.94 12.26,16.81 U15.2 13.07,16.41 U15.PAD | 14.09,17.51 C58.2 | 14.99,16.47 U17.PAD 15.14,16.42 v15.22,16.47 | 7.69,12.16 7.69,11.46 U3.PAD | U9.B3 U9.B2 | 18.97,14.25 C12.2 | U10.7 18.46,11.45 17.93,11.45 17.27,11.45 17.17,11.35 v17.17,10.6 17.5,10.93 U10.6 | C15.2 16.35,6.58 v16.29,6.64 | v15.07,7.19 15.26,7.19 15.29,7.17 | v13.51,7.36 v13.51,7.35 13.57,7.29 | v17.64,13.46 17.7,13.52 C18.2 17.46,13.64 v17.43,13.67 | v19.92,12.99 19.92,13.13 C13.2 | U11.B3 U11.B2 | C8.2 v3.85,15.19 | v3.57,13.16 C7.2 | v6.07,20.93 6.07,20.73 C66.2 | C32.2 v15.72,22.09 15.72,21.86 R26.1 | v3.13,17.38 3.42,17.38 R46.2 | C36.2 8.9,20.01 v8.83,20.01 | v8.4,22.59 9.16,22.84 C35.2 | U4.4 10.97,10.66 v10.97,9.71
  Bottom 0.15: C61.2 v12.33,20.26 | C62.2 v13.37,20.3
  Bottom 0.2: C3.2 15.72,21.99 v15.72,22.09
  other vias: 11.27,19.6 14.47,19.6 12.07,21.2 13.27,22 11.27,22.4 12.87,20.8 14.47,21.2 5.43,16.92 9.52,21.65 18.48,17.26 17.85,18.19 18.68,16.74 16.32,20.75 5.65,11.4 6.57,8.96 6.9,10.13 3.49,18.3 17.94,18.95 16.13,20.16 17.85,17.91 14.16,17.95 19.21,16.68 18.12,17.23 14.21,16.61 14.03,16.78 18.06,18.05 5.19,10.36 7.55,9.5 7.51,9.05 18.09,17.82 18.18,17.57 18.33,17.97 18.85,17.74 14.38,17.88 13.86,16.97 17.59,17.95 17.51,16.76 16.78,17.63 19.68,16.51 19.39,16.9 18.95,16.89 17.62,17.72 18.91,17.35 18.74,17.52 5.33,18.41 6.77,16.82 6.77,17.37 6.79,18.23 5.92,11.09 17.55,18.24 18.61,17.96 12.87,19.6 8.64,8.6 17.8,17.37 14.42,13.95 14.92,11.35 14.37,13.1 13.66,17.22 14.75,17.3 15.67,11.35 16.42,11.35 14.92,10.6 15.67,10.6 16.42,10.6 14.92,9.85 15.67,9.85 17.17,9.85 14.92,9.1 15.67,9.1 16.42,9.1 13.62,13.1 12.67,13.2 12.32,13.4 14.12,13.75 13.52,13.8 12.96,13.86 11.21,13.4 11.02,13.75 12.04,15.36 13.87,21.4 10.72,13.78 9.74,15.38 11.15,15.13 12.96,15.24 12.95,14.51 13.98,14.22 14.2,15.21 11.97,13.42 9.83,13.36 8.83,13.25 6.1,9.44 5.65,9.9 6.25,10.78 7.21,9.8 6.34,9.2 5.43,10.12 5.87,9.67 5.29,9.04 5.53,8.87 5.12,9.27 7.72,8.87 8.88,12.87 13.41,15.2 17.89,17.61 11.47,17.69 11.07,17.41 10.35,22.42 11.27,20.8 10.46,15.17 8.84,15.17 12.56,16.87 12.27,16.67 13.12,16.58 13.09,16.14 13.3,16.37 12.91,16.38 12.59,16.58 14.97,16.53 16.77,16.97 17.47,17.03 17.84,17.06 18.2,16.72 18.38,16.99 19.19,17.09 18.76,17.13 18.5,17.58 17.86,16.68 16.77,17.32 12.92,16.91 12.86,16.64 5.43,17.19 5.42,17.51 5.51,18.59 6.39,17.75 6.5,17.09 20.43,15.66 13.42,14.35 14.27,14.55 10.53,13.51 11.08,12.86 8.87,13.65 11.15,14.46 10.51,14.02 5.8,20.8 15.97,19.14 4.21,19.57 5.63,19.13 12.75,17.21 14.73,21.89 9.22,7.17 12.37,5.16 11.56,5.11 11.56,9.71 11.82,11.05 12.32,11.05 14.14,5.19
  pour GND2 (isolate 0.02, rank 2): -0.23,4.1 -0.23,16.38 7.29,23.9 15.79,23.9 23.37,16.32 23.37,4.1
  pour Top (isolate 0.1, rank 4, no thermals): 10.32,18.22 10.32,17.14 11.37,17.14 11.75,16.76 11.75,16.44 15.47,16.44 15.47,18.22
  pour Bottom (isolate 0.05, rank 2, no thermals): 0.77,17.1 7.57,23.9 15.8,23.9 21.87,17.83 21.87,17.1
  pour Top (isolate 0.1, rank 4, no thermals): 16.57,17 16.87,16.7 16.87,16.4 17.17,16.4 17.27,16.3 20.57,16.3 20.57,18.4 16.57,18.4
  pour Top (isolate 0.05, rank 2, no thermals): 8.67,15.4 8.67,12.55 14.57,12.55 14.57,15.45 8.67,15.45
  pour Top (rank 2, no thermals): 18.72,13.37 18.72,14.33 19.83,14.33 19.83,13.37
  pour GND3 (isolate 0.02, rank 2): -1.23,4.1 -1.23,15.3 7.37,23.9 15.81,23.9 23.87,15.84 23.87,4.1
  pour GND1 (isolate 0.02, rank 2): 1.27,4.1 1.27,17.61 7.56,23.9 15.78,23.9 22.37,17.31 22.37,4.1
GND1  (via drill 0.1)
  Top 0.3: J4.2 v2.16,23.96
  Top 0.4: J4.4 0.74,22.55 v0.74,22.27
  other vias: 1.17,22.69 1.2,21.67 1.8,21.06 2.33,20.53 3.16,20.58 2.73,20.41 3.29,23.19 4,22.41 4.67,22.09 5.55,22.93 4.42,24.53 3.64,21.06 4.21,21.63 4.95,24 4.13,23.5 3.93,23.31 5.09,22.44 1.94,21.7 2.65,20.99 2.9,24.78
  pour Bottom (isolate 0.02, rank 2, no thermals): 6.15,23.15 2.69,19.69 0,22.37 3.46,25.84
  pour Top (isolate 0.02, rank 2, no thermals): 6.15,23.15 2.69,19.69 0,22.37 3.46,25.84
  pour GND2 (isolate 0.02, rank 2, no thermals): 6.15,23.15 2.69,19.69 0,22.37 3.46,25.84
  pour AGND/PWR (isolate 0.02, rank 2, no thermals): 6.15,23.15 2.69,19.69 0,22.37 3.46,25.84
GND2  (via drill 0.1)
  Top 0.4: J2.4 13.42,0.8 v13.62,0.6 | J2.2 11.07,0.15
  Bottom 0.2: J2.4 13.42,0.7
  other vias: 13.02,0.6 13.72,1.35 13.72,2.2 13.72,2.95 13.1,3.5 13.53,3.32 11.17,1.75 11.22,2.8 10.97,3.5 9.75,3.53 9.42,1.6 12.42,3.5 11.62,3.5 9.42,2.35 10.76,2.15 10.47,2.13 10.42,3.55 13.17,1.85 13.17,2.85 11.42,0.4 10.32,0.35
  pour Bottom (isolate 0.02, rank 2, no thermals): 9.17,3.8 14.07,3.8 14.07,0 9.17,0
  pour GND2 (isolate 0.02, rank 2, no thermals): 9.17,3.8 14.07,3.8 14.07,0 9.17,0
  pour AGND/PWR (isolate 0.02, rank 2, no thermals): 9.17,3.8 14.07,3.8 14.07,0 9.17,0
  pour Top (isolate 0.02, rank 2, no thermals): 9.17,3.8 14.07,3.8 14.07,0 9.17,0
GND3  (via drill 0.1)
  Top 0.4: J7.4 19.83,24.74 v19.83,25.02 | J7.2 21.96,23.54
  Bottom 0.2: J7.4 19.91,24.81
  other vias: 20.26,24.6 19.23,24.57 18.63,23.96 18.1,23.43 18.15,22.61 17.97,23.04 20.75,22.48 19.98,21.77 19.66,21.1 20.5,20.22 22.1,21.35 18.63,22.13 19.2,21.56 21.57,20.82 20.84,21.86 21.04,21.65 20.01,20.68 19.27,23.82 18.56,23.12 21.53,23.61 22.34,22.87
  pour Bottom (isolate 0.02, rank 2, no thermals): 20.72,19.62 17.25,23.08 19.94,25.77 23.41,22.3
  pour Top (isolate 0.02, rank 2, no thermals): 20.72,19.62 17.25,23.08 19.94,25.77 23.41,22.3
  pour GND2 (isolate 0.02, rank 2, no thermals): 20.72,19.62 17.25,23.08 19.94,25.77 23.41,22.3
  pour AGND/PWR (isolate 0.02, rank 2, no thermals): 20.72,19.62 17.25,23.08 19.94,25.77 23.41,22.3
GPIO0  (via drill 0.1, 0.1 layers 1-6)
  Top 0.051: v18.03,11.2 19.89,11.2 TP4.TP
  Top 0.076: TP4.TP 20.15,11.13 v20.17,11.11
  Route3 0.076: v20.17,11.11 20.29,11.23 20.29,13.08 19.99,13.37 19.99,14.82 20.82,15.65 20.51,16.95 20.27,17.51 17.9,19.88 16.83,19.88 16.03,20.68 16.03,20.88 14.7,22.21 13.86,22.21 U14.A3 | v18.03,11.2 17.17,11.2 16.62,11.75 15.53,11.75 14.83,12.45 U10.15
  Bottom 0.076: v20.17,11.11 20.07,11.01 J9.3
  other vias: 14.83,12.59 13.67,22.4
GPIO1  (via drill 0.1 layers 1-6)
  Route3 0.076: U10.16 14.3,12.58 13.42,11.7 10.87,11.7 10.77,11.6 8.97,11.6 8.42,12.15 8.42,12.7 8.12,13 8.12,14.3 8.42,14.6 8.42,15.2 9.82,16.6 11.82,16.6 12.87,17.65 12.87,18.78 12.67,18.98 12.67,19.4 U14.H6
  other vias: 14.33,12.59 12.47,19.6
HSYNC  (via drill 0.1 layers 1-6)
  Top 0.076: v17.93,8.65 18.15,8.43 U10.1
  Route3 0.076: U14.F2 14.27,20.2 14.82,20.2 15.77,19.25 15.77,17.64 19.22,14.19 19.22,9.4 18.47,8.65 v17.93,8.65
  other vias: 14.07,20.4
IMU_BL_IND  (1 unrouted)
IMU_SCL  (via drill 0.1 layers 1-6)
  Top 0.127: R56.1 7.42,15.95 v7.42,16
  Route2/PWR 0.076: U14.E3 13.54,20.8 13.35,20.99 12.79,20.99 12.68,20.88 12.68,20.66 12.61,20.59 11.99,20.59 11.86,20.46 11.86,18.98 10.38,17.51 7.48,17.51 7.09,17.12 7.09,15.74 | 7.09,15.74 5.51,14.16 5.51,12.87 6.16,12.22 6.32,12.22 8.41,10.13 8.49,10.13 8.8,9.82 9.95,9.82 U21.19 | v7.42,16 7.16,15.74 7.09,15.74
  other vias: 13.67,20.8 10.06,9.71
IMU_SDA  (via drill 0.1, 0.1 layers 1-6)
  Top 0.076: v9.25,9.63 U21.20
  Top 0.102: U14.F9
  Route2/PWR 0.051: v11.05,18.65 11.05,18.67 R57.1
  Route2/PWR 0.076: U14.F9 11.02,20.15 R57.1 11.02,18.37 10.28,17.64 7.32,17.64 7.18,17.5 6.58,16.9 6.58,15.7 5.07,14.19 5.07,13.02 8.44,9.64 9.23,9.64 v9.25,9.63
  Bottom 0.051: R57.1 11.02,18.68 v11.05,18.65
  other vias: 11.27,20.4
ISTIM  (via drill 0.1)
  Route3 0.1: v18.77,15.47 18.77,15.95 19.82,17 v19.82,17.59 v19.81,17.6
  Bottom 0.076: 18.47,14.5 J8.1
  Bottom 0.1: U5.10 18.29,18.27 18.53,18.51 U5.6 19.46,18.51 19.81,18.16 v19.81,17.6 | v18.77,15.47 18.47,15.17 J8.1
ISTIM_MONO  (via drill 0.1, 0.1 layers 1-6)
  Route2/PWR 0.076: 9.79,4.98 9.63,5.01 9.06,5.19 8.62,5.34 v7.67,5.81 | 9.79,4.98 | 9.79,4.98 10.54,4.85 12.14,4.91 13.15,4.91 13.44,4.96 14.25,5.76 v14.31,5.76
  Route3 0.076: v7.67,5.81 7.37,5.85 7.27,5.9 6.52,6.31 6.33,6.46 5.97,6.82 5.97,7.74 4.18,9.53 4.18,9.96 3.08,11.06 3.08,13.24 3.32,13.48 3.32,14.8 2.87,15.25 2.87,16.7 3.72,17.55 3.72,18.89 v3.95,19.12
  Bottom 0.076: 13.68,6.08 U8.N5 14.01,5.76 v14.31,5.76 | R14.1 4.4,19.06 | 4.4,19.06 R19.2 | v3.95,19.12 4.35,19.12 4.4,19.06
ISTIM_PRE  (via drill 0.1, 0.1 layers 7-16)
  Route2/PWR 0.076: 12.69,23.35 12.88,23.32 12.89,23.32 12.98,23.3
  Route2/PWR 0.1: v18.95,17.99 18.95,18.54 17.01,20.48 17.01,21.71 16.93,21.77 16.56,22.04 15.7,22.48 | 12.69,23.35 12.4,23.4 10.93,23.4 9.76,23.21 9.48,23.16 8.08,22.71 7.49,22.4 7.08,22 v7.08,21.88 | 12.98,23.3 13.86,23.16 14.89,22.83 15.26,22.71 15.7,22.48 | 15.7,22.48